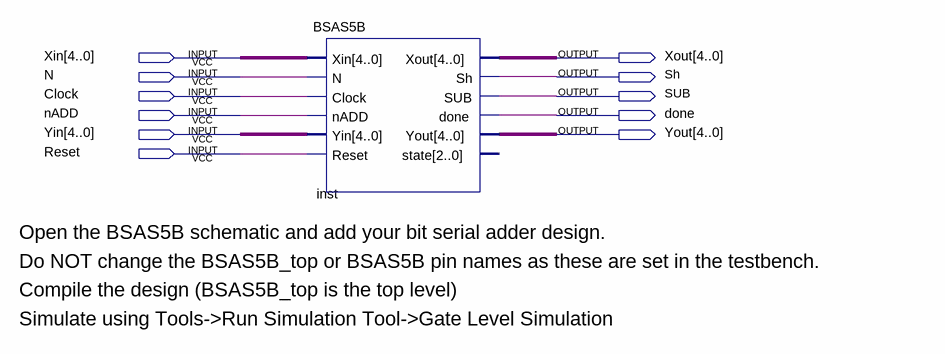
[diagram p0: schematic sheet]
// Quartus schematic BSAS5B_top.bdf as structural Verilog: 1 symbols, 11 pins
module BSAS5B_top (
  input  [4:0] Xin,
  input  N,
  input  Clock,
  input  nADD,
  input  [4:0] Yin,
  input  Reset,
  output [4:0] Xout,
  output Sh,
  output SUB,
  output done,
  output [4:0] Yout
);

  BSAS5B inst (
    .Xin(Xin), .N(N), .Clock(Clock), .nADD(nADD), .Yin(Yin), .Reset(Reset), .Xout(Xout), .Sh(Sh), .SUB(SUB),
    .done(done), .Yout(Yout));  // open: state

  // Notes on the sheet:
  //   Open the BSAS5B schematic and add your bit serial adder design. 
  //   Do NOT change the BSAS5B_top or BSAS5B pin names as these are set in the testbench.
  //   Compile the design (BSAS5B_top is the top level)
  //   Simulate using Tools->Run Simulation Tool->Gate Level Simulation
endmodule
